# Altium project 28pins_project_V1I1.PrjPcb (part 1 of 3)
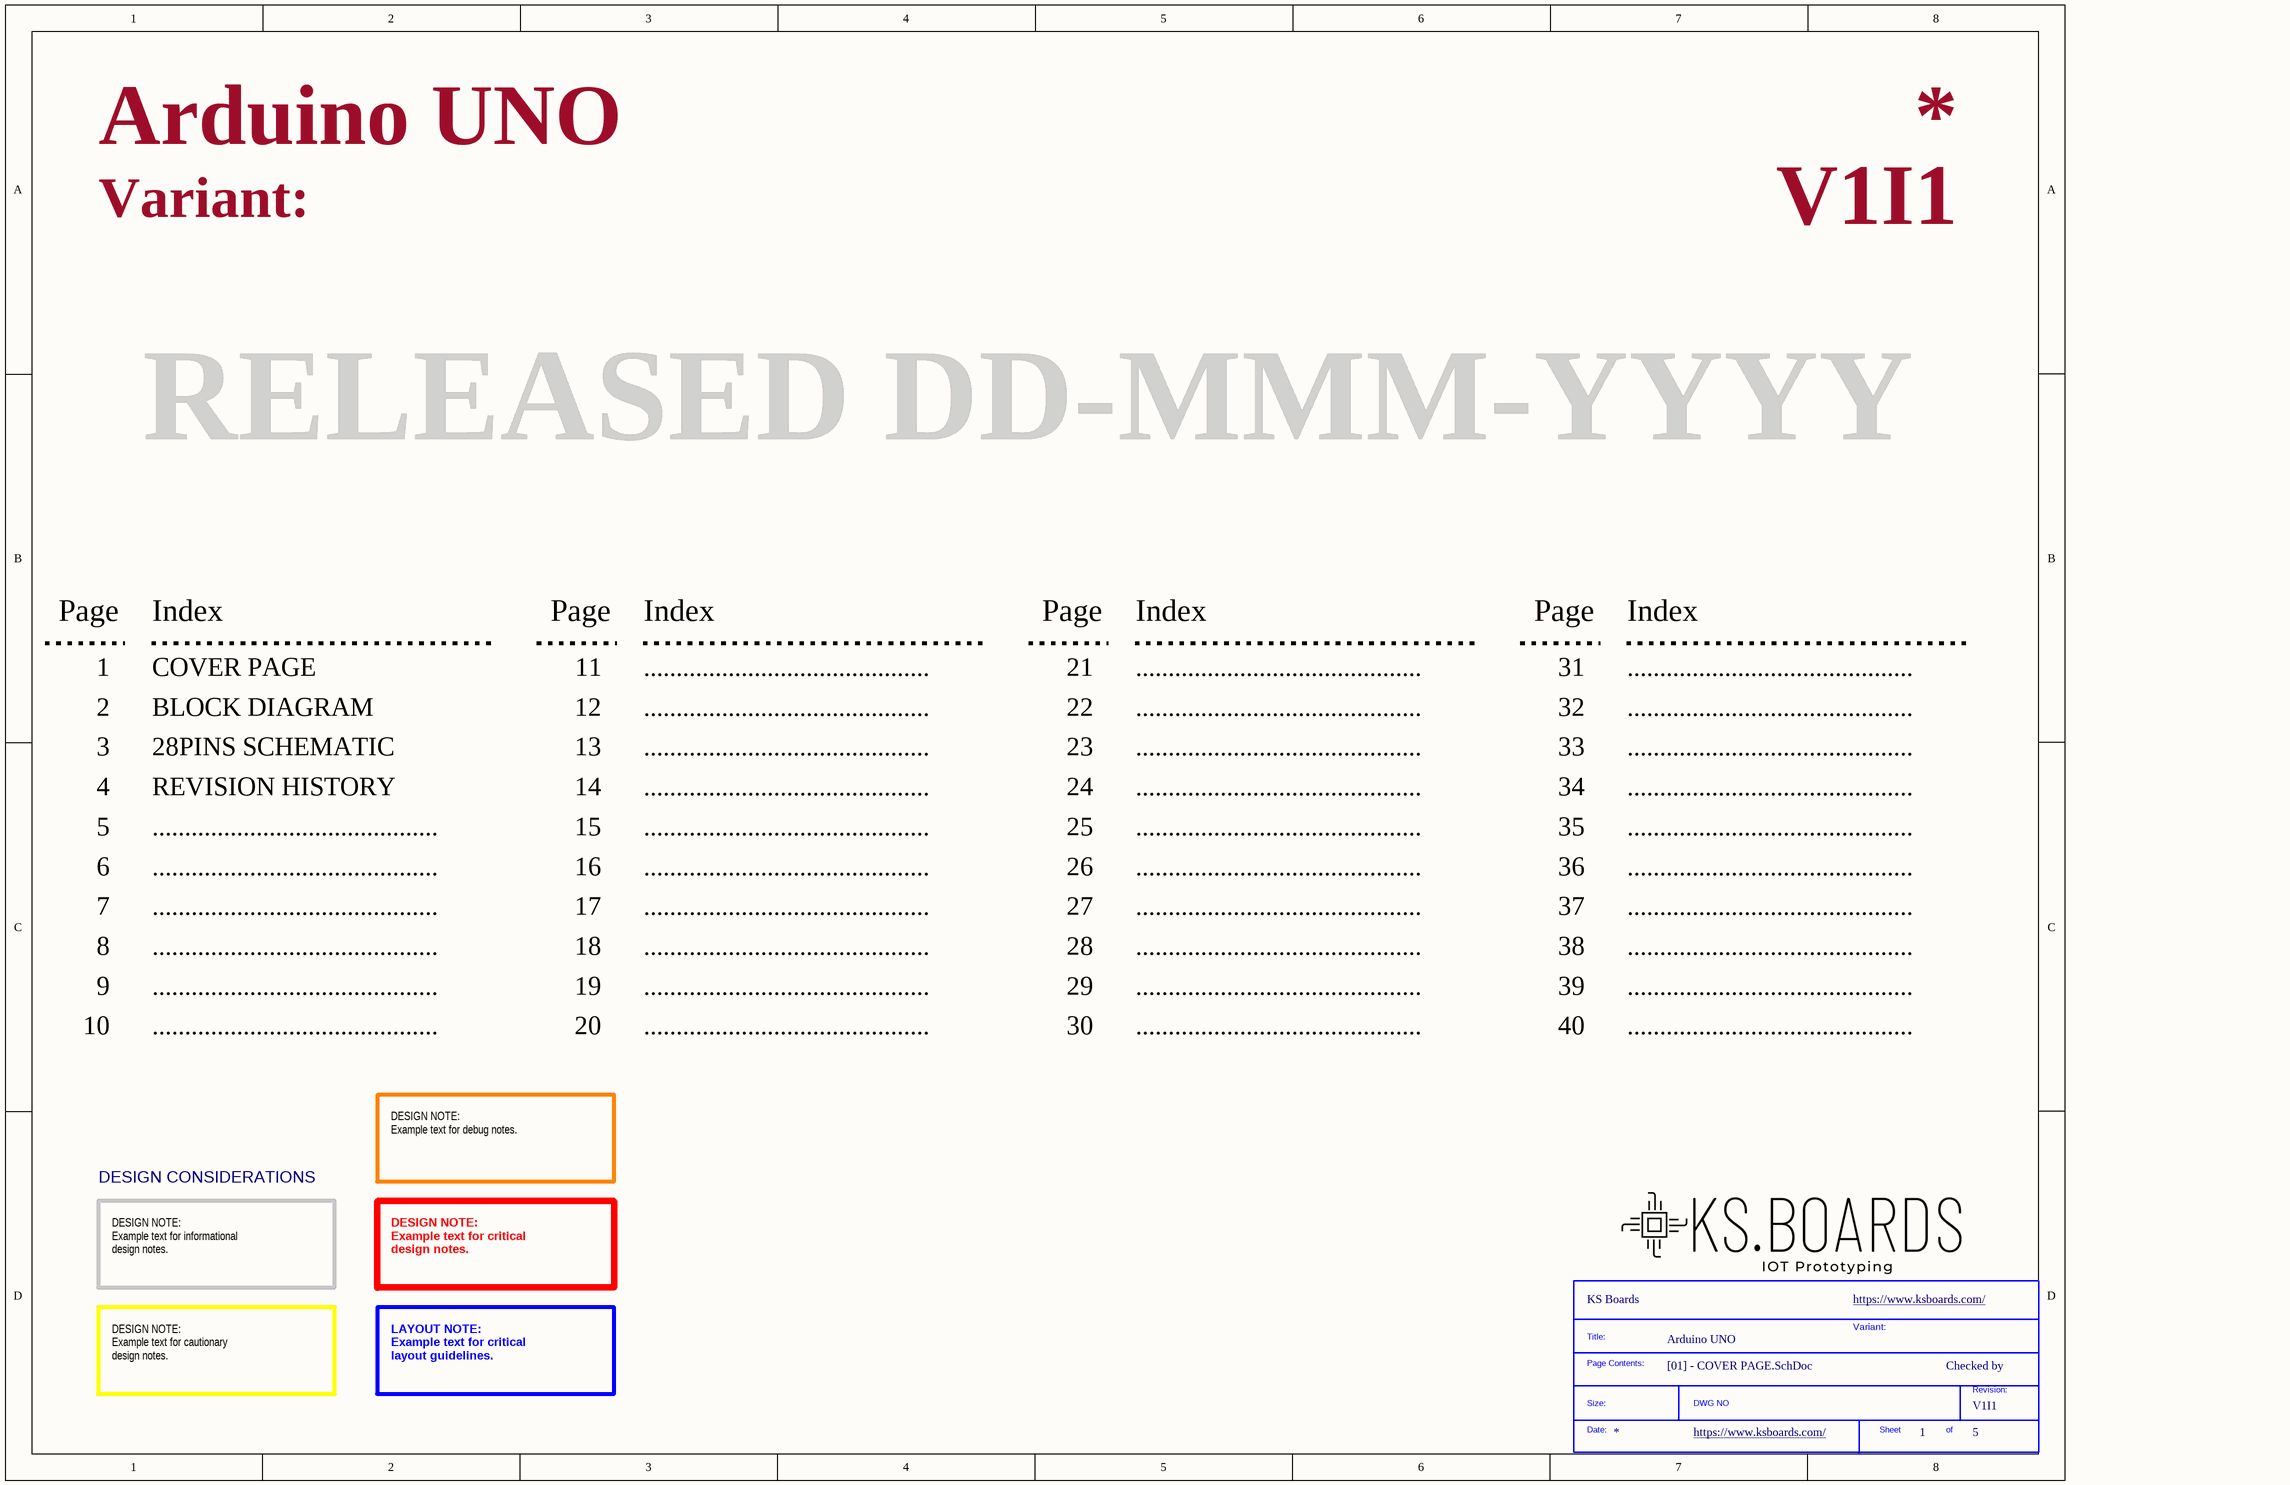
[diagram p0: [01] - COVER PAGE.SchDoc]
Company: KS Boards; Not fitted: NF; Project: Arduino UNO; Title: Arduino Uno; URL: https://www.ksboards.com/; VersionRevision: V1I1
4 sheets, 117 parts. Net scope: global (net labels, ports and power ports of the same name join across sheets).
Board file: 28pins_PCB.PcbDoc
Sheets:
  [01] - COVER PAGE.SchDoc
  [02] - BLOCK DIAGRAM.SchDoc
  [03] - 28PINS SCHEMATIC.SchDoc
  [04] - REVISION HISTORY.SchDoc

## Sheet [01] - COVER PAGE.SchDoc: Arduino Uno
size A3; DocumentNumber: 1; SheetNumber: 1; SheetTotal: 5

### Parts
(Parts that share a designator on the sheet are numbered #1, #2 ... from top to bottom, then left to right.)
*#1  SDTitleBlock  (value not drawn)  (graphical)
LOGO#1  LOGO  (value not drawn)  (graphical)

### Notes on the sheet
- Variant:
- RELEASED DD-MMM-YYYY
- Page
- Index
- 1
- COVER PAGE
- 11
- ............................................
- 21
- 31
- 2
- 3
- BLOCK DIAGRAM
- 28PINS SCHEMATIC
- 12
- 13
- 22
- 23
- 32
- 33
- 4
- 5
- REVISION HISTORY
- 14
- 15
- 24
- 25
- 34
- 35
- 6
- 16
- 26
- 36
- 7
- 8
- 17
- 18
- 27
- 28
- 37
- 38
- 9
- 10
- 19
- 20
- 29
- 30
- 39
- 40
- DESIGN NOTE:
  Example text for debug notes.
- DESIGN CONSIDERATIONS
- DESIGN NOTE:
  Example text for informational
  design notes.
- DESIGN NOTE:
  Example text for critical
  design notes.
- Checked by
- DESIGN NOTE:
  Example text for cautionary
  design notes.
- LAYOUT NOTE:
  Example text for critical
  layout guidelines.
- (in symbol SDTitleBlock) Title:; Page Contents:; Revision:; Size:; DWG NO; Date:; Sheet; of

## Sheet [02] - BLOCK DIAGRAM.SchDoc: Arduino Uno
size A3; DocumentNumber: 2; SheetNumber: 2; SheetTotal: 5; PageSetup: Record=PageOptions|CenterHorizontal=True|CenterVertical=True|PrintScale=0.52|XCorrection=1.00|YCorrection=1.00|PrintKind=1|BorderSize=5000000|LeftOffset=0|BottomOffset=0|Orientation=2|PaperLength=1000|PaperWidth=1000|Scale=100|PaperSource=4|PrintQuality=600|MediaType=1|DitherType=10|PrintScaleMode=1|PaperKind=A4|PaperIndex=9
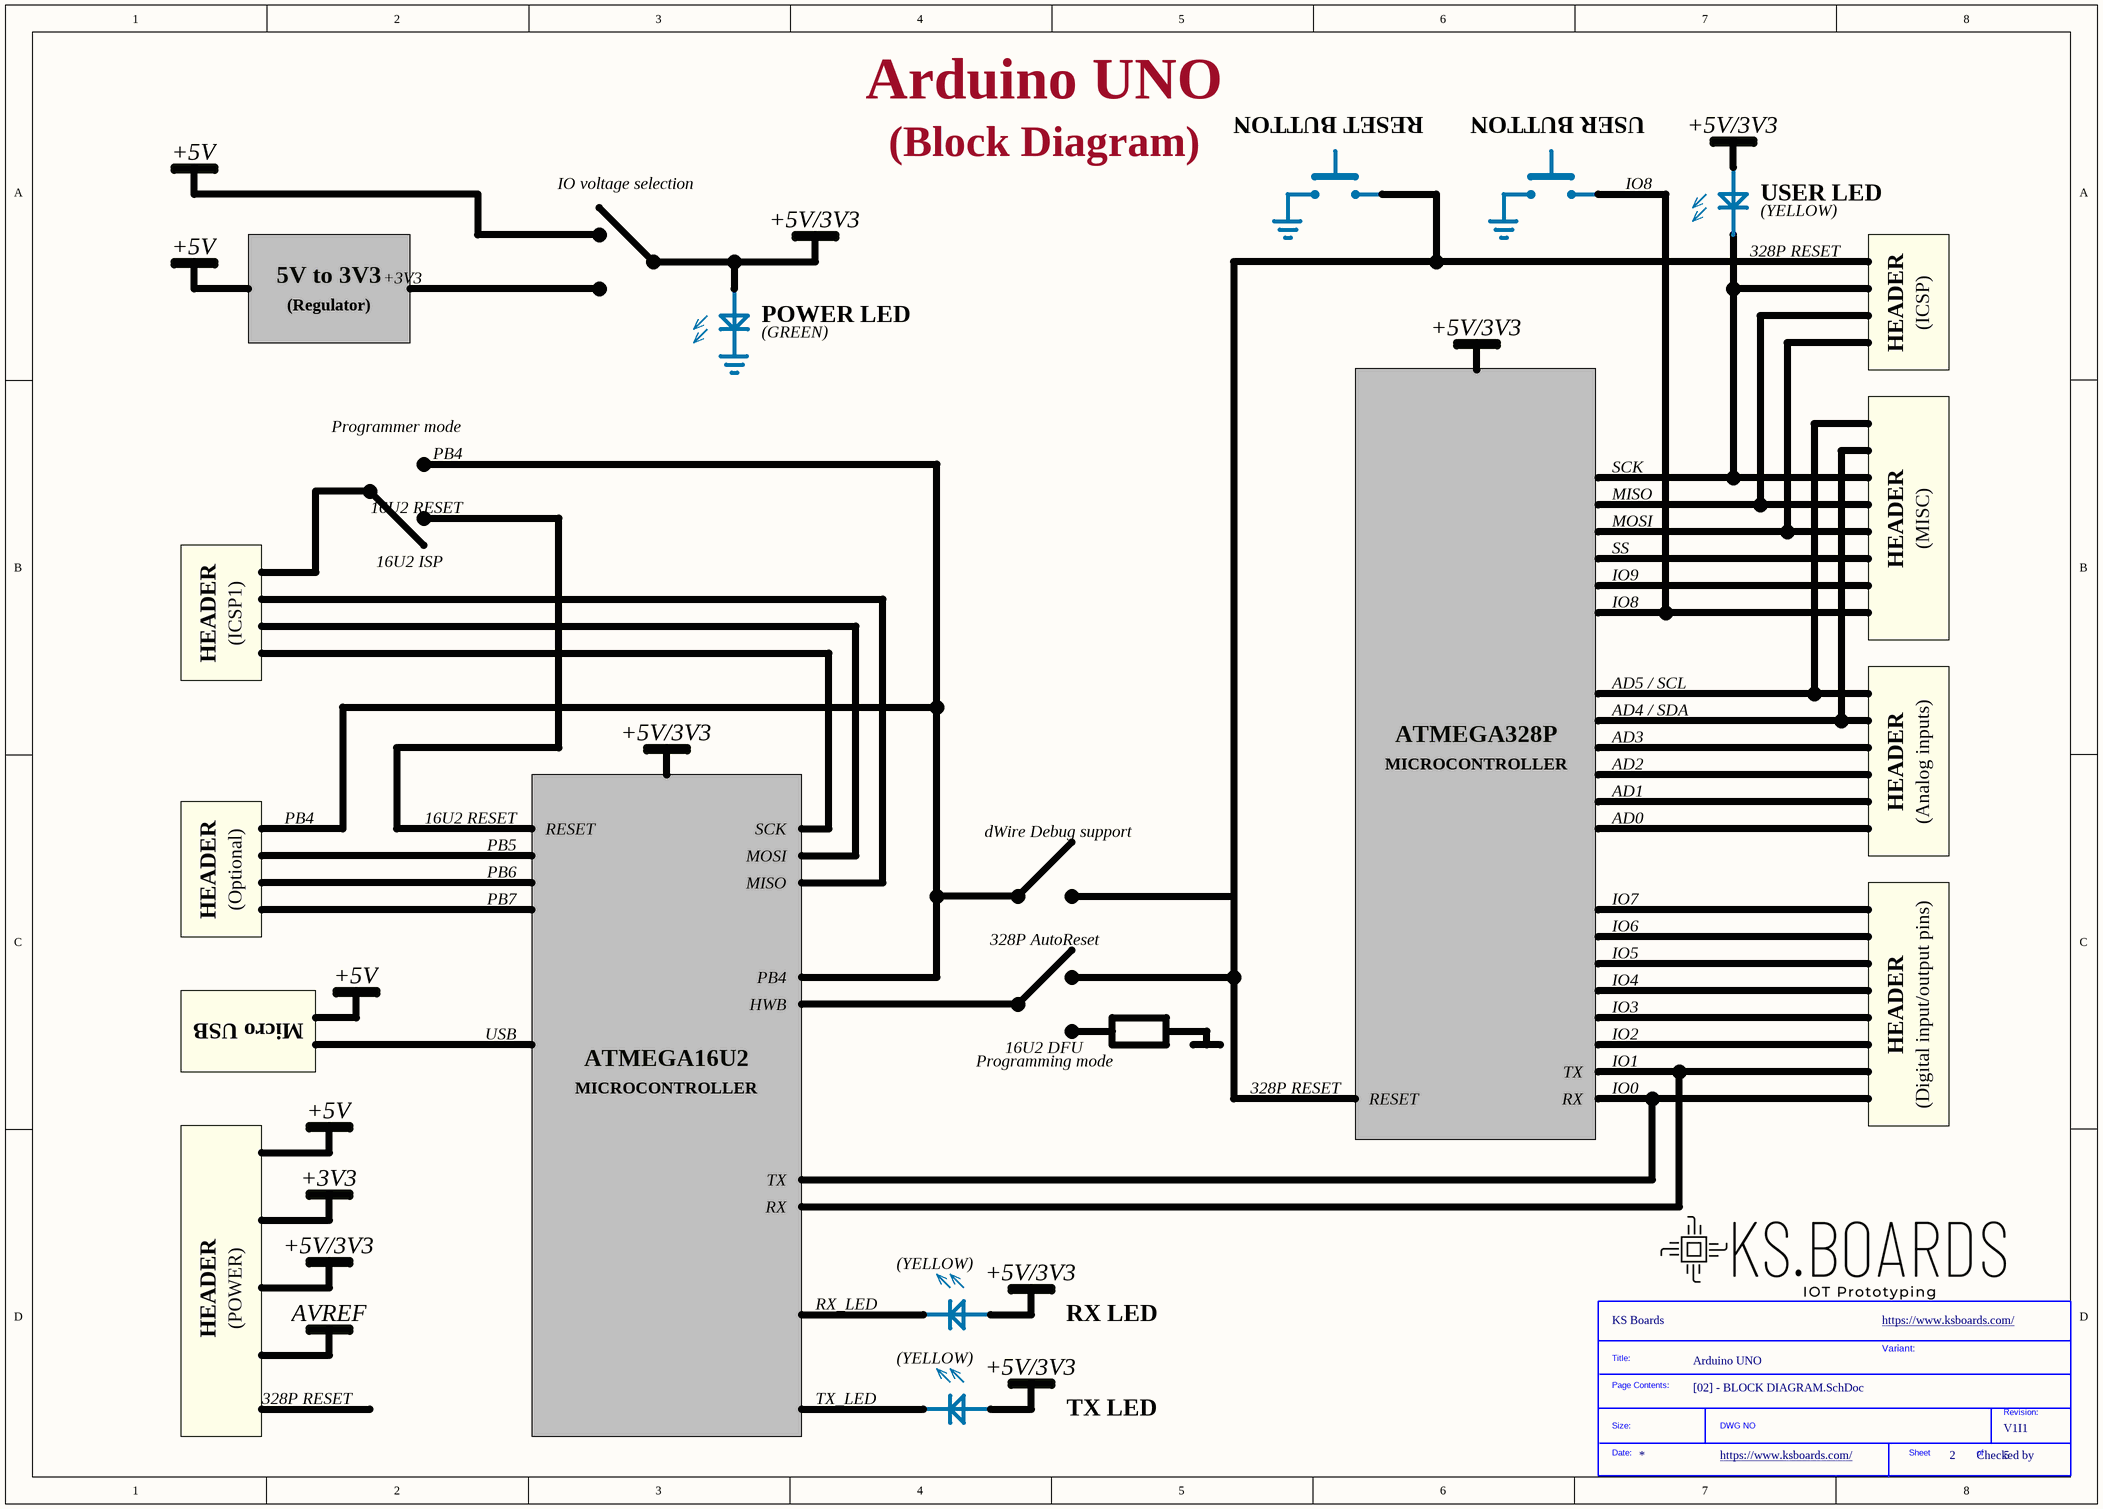
[diagram p1: [02] - BLOCK DIAGRAM.SchDoc]

### Parts
(Parts that share a designator on the sheet are numbered #1, #2 ... from top to bottom, then left to right.)
*#2  SDTitleBlock  (value not drawn)  (graphical)
LOGO#2  LOGO  (value not drawn)  (graphical)

### Notes on the sheet
- +5V
- (Block Diagram)
- RESET BUTTON
- USER BUTTON
- +5V/3V3
- IO voltage selection
- IO8
- USER LED
- (YELLOW)
- 5V to 3V3
- (Regulator)
- +3V3
- 328P RESET
- HEADER
- (ICSP)
- POWER LED
- (GREEN)
- Programmer mode
- PB4
- 16U2 RESET
- MISO
- SCK
- (MISC)
- 16U2 ISP
- SS
- IO9
- MOSI
- (ICSP1)
- AD5 / SCL
- AD4 / SDA
- ATMEGA328P
- MICROCONTROLLER
- AD3
- AD2
- (Analog inputs)
- PB5
- RESET
- dWire Debug support
- AD1
- AD0
- (Optional)
- PB6
- PB7
- IO7
- 328P AutoReset
- IO6
- IO5
- IO4
- Micro USB
- USB
- ATMEGA16U2
- HWB
- 16U2 DFU
- IO3
- IO2
- (Digital input/output pins)
- Programming mode
- RX
- TX
- IO1
- IO0
- (POWER)
- AVREF
- RX_LED
- RX LED
- Variant:
- TX_LED
- TX LED
- Checked by
- (in symbol SDTitleBlock) Title:; Page Contents:; Revision:; Size:; DWG NO; Date:; Sheet; of

## Sheet [03] - 28PINS SCHEMATIC.SchDoc: Arduino Uno
size A2; DocumentNumber: 3; SheetNumber: 3; SheetTotal: 5
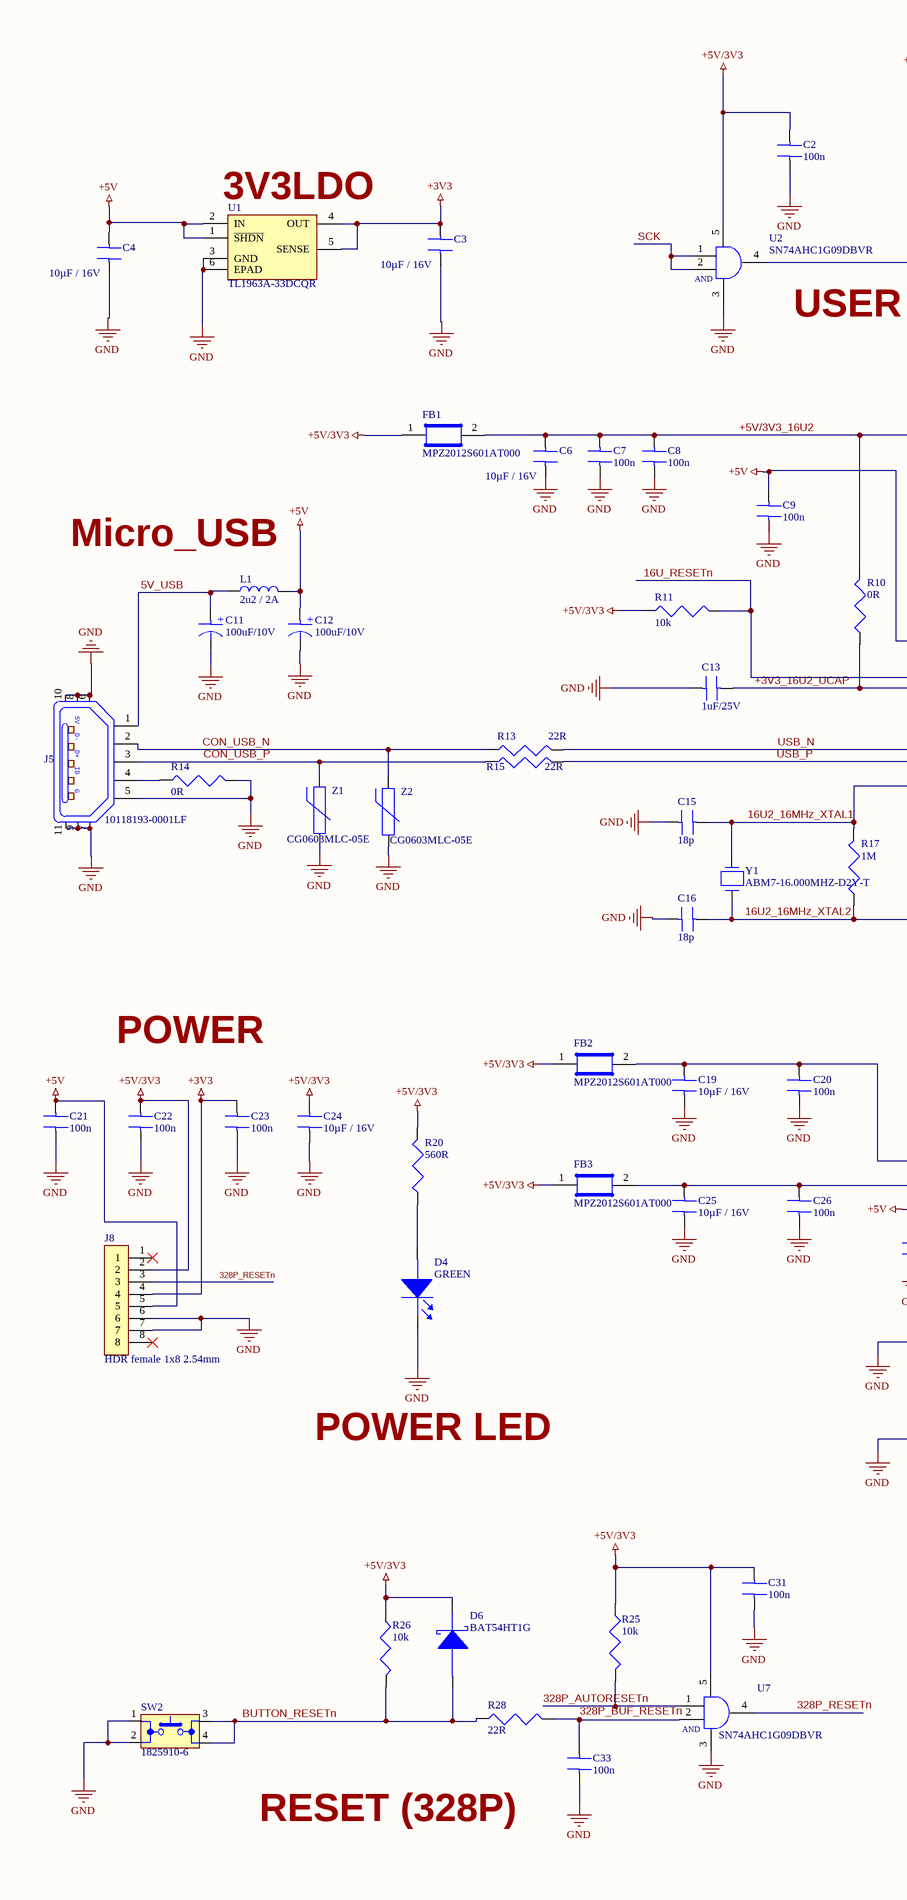
[diagram p2: [03] - 28PINS SCHEMATIC.SchDoc, left]
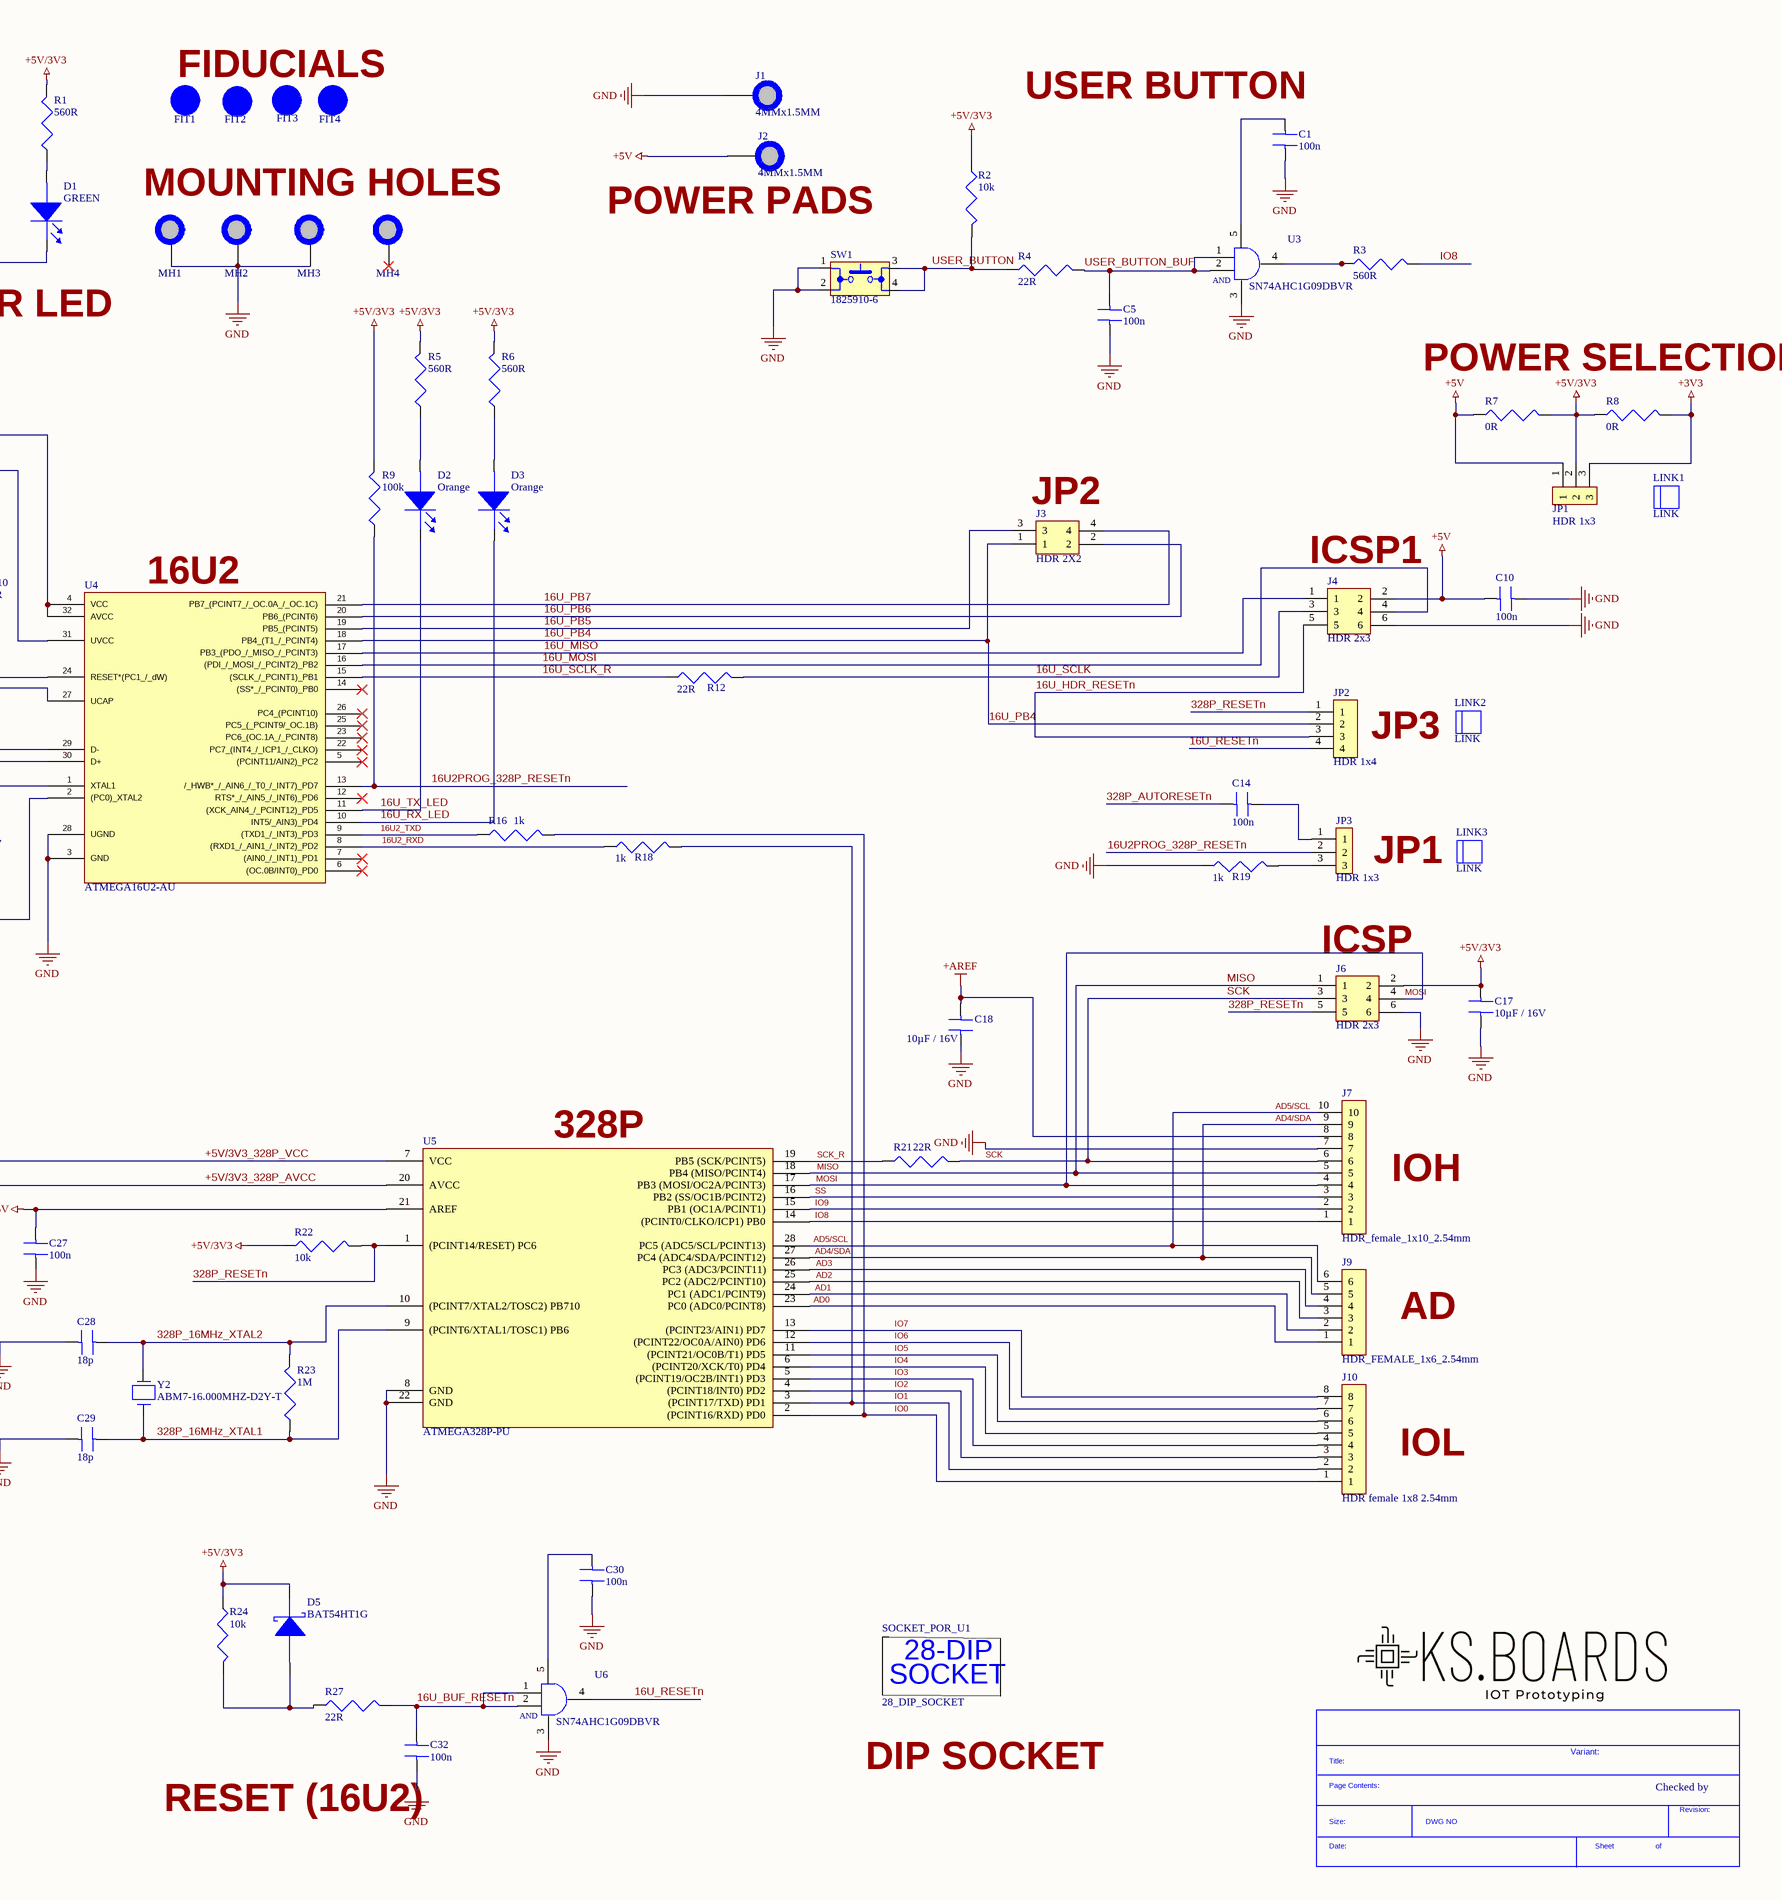
[diagram p3: [03] - 28PINS SCHEMATIC.SchDoc, right]

### Parts
(Parts that share a designator on the sheet are numbered #1, #2 ... from top to bottom, then left to right.)
*?  SDTitleBlock  (value not drawn)  (graphical)
C1  100n  [C0805]
C2  100n  [C0805]
C3  10µF / 16V  [C0805]
C4  10µF / 16V  [C0805]
C5  100n  [C0805]
C6  10µF / 16V  [C0805]
C7  100n  [C0805]
C8  100n  [C0805]
C9  100n  [C0805]
C10  100n  [C0805]
C11  100uF/10V  [C_ALU_C_SIZE]
C12  100uF/10V  [C_ALU_C_SIZE]
C13  1uF/25V  [C0805]
C14  100n  [C0805]
C15  18p  [C0805]
C16  18p  [C0805]
C17  10µF / 16V  [C0805]
C18  10µF / 16V  [C0805]
C19  10µF / 16V  [C0805]
C20  100n  [C0805]
C21  100n  [C0805]
C22  100n  [C0805]
C23  100n  [C0805]
C24  10µF / 16V  [C0805]
C25  10µF / 16V  [C0805]
C26  100n  [C0805]
C27  100n  [C0805]
C28  18p  [C0805]
C29  18p  [C0805]
C30  100n  [C0805]
C31  100n  [C0805]
C32  100n  [C0805]
C33  100n  [C0805]
D1  GREEN  [LED_0603]
D2  Orange  [LED_0603]
D3  Orange  [LED_0603]
D4  GREEN  [LED_0603]
D5  BAT54HT1G  [SOD323]
D6  BAT54HT1G  [SOD323]
FB1  MPZ2012S601AT000  [C0805]
FB2  MPZ2012S601AT000  [C0805]
FB3  MPZ2012S601AT000  [C0805]
FIT1  FIT_1MM  [FIT_40x120]  (value not drawn)  (no BOM)
FIT2  FIT_1MM  [FIT_40x120]  (value not drawn)  (no BOM)
FIT3  FIT_1MM  [FIT_40x120]  (value not drawn)  (no BOM)
FIT4  FIT_1MM  [FIT_40x120]  (value not drawn)  (no BOM)
J1  4MMx1.5MM  [PAD_WITH_HOLE_4MMx1.5MM]  (no BOM)
J2  4MMx1.5MM  [PAD_WITH_HOLE_4MMx1.5MM]  (no BOM)
J3  HDR 2X2  [HDR_2x2_2.54mm]
J4  HDR 2x3  [HDR_2x3_2.54mm]
J5  10118193-0001LF  [10118193]
J6  HDR 2x3  [HDR_2x3_2.54mm]
J7  HDR_female_1x10_2.54mm  [HDR_FEMALE_1x10_2.54mm]
J8  HDR female 1x8 2.54mm  [HDR_FEMALE_1x8_2.54mm]
J9  HDR_FEMALE_1x6_2.54mm  [HDR_FEMALE_1x6_2.54mm]
J10  HDR female 1x8 2.54mm  [HDR_FEMALE_1x8_2.54mm]
JP1  HDR 1x3  [HDR_FEMALE_1x3_2.54mm]
JP2  HDR 1x4  [HDR_FEMALE_1x4_2.54mm]
JP3  HDR 1x3  [HDR_FEMALE_1x3_2.54mm]
L1  2u2 / 2A  [C1210_IND]
LINK1  LINK  (mechanical)
LINK2  LINK  (mechanical)
LINK3  LINK  (mechanical)
LOGO#3  LOGO  (value not drawn)  (graphical)
MH1  MH_7.4MMC_3.4MMD  [MH_7.4MMx3.2MM]  (value not drawn)  (no BOM)
MH2  MH_7.4MMC_3.4MMD  [MH_7.4MMx3.2MM]  (value not drawn)  (no BOM)
MH3  MH_7.4MMC_3.4MMD  [MH_7.4MMx3.2MM]  (value not drawn)  (no BOM)
MH4  MH_7.4MMNC_3.2MMD  [MH_7.4MMC_3.2MMD_NON_COPPER_NPHT]  (value not drawn)  (no BOM)
R1  560R  [R0805]
R2  10k  [R0805]
R3  560R  [R0805]
R4  22R  [R0805]
R5  560R  [R0805]
R6  560R  [R0805]
R7  0R  [R0805]
R8  0R  [R0805]
R9  100k  [R0805]
R10  0R  [R0805]
R11  10k  [R0805]
R12  22R  [R0805]
R13  22R  [R0805]
R14  0R  [R0805]
R15  22R  [R0805]
R16  1k  [R0805]
R17  1M  [R0805]
R18  1k  [R0805]
R19  1k  [R0805]
R20  560R  [R0805]
R21  22R  [R0805]
R22  10k  [R0805]
R23  1M  [R0805]
R24  10k  [R0805]
R25  10k  [R0805]
R26  10k  [R0805]
R27  22R  [R0805]
R28  22R  [R0805]
SOCKET_POR_U1  28_DIP_SOCKET  [28_DIP_7.62MM_SOCKET]
SW1  1825910-6  [1825910-6]
SW2  1825910-6  [1825910-6]
U1  TL1963A-33DCQR  [DCQ-R-PDSO-G6]
U2  SN74AHC1G09DBVR  [DBV_SOT_23]
U3  SN74AHC1G09DBVR  [DBV_SOT_23]
U4  ATMEGA16U2-AU  [TQFP32]
U5  ATMEGA328P-PU  [28_DIP_7.62MM]
U6  SN74AHC1G09DBVR  [DBV_SOT_23]
U7  SN74AHC1G09DBVR  [DBV_SOT_23]
Y1  ABM7-16.000MHZ-D2Y-T  [ABM7_v1_1_BIG]
Y2  ABM7-16.000MHZ-D2Y-T  [ABM7_v1_1_BIG]
Z1  CG0603MLC-05E  [R0603]
Z2  CG0603MLC-05E  [R0603]

### Nets
+3V3: C3.2 C23.2 J8.4 JP1.3 R8.2 U1.4(OUT) U1.5(SENSE)
+5V: C4.2 C9.2 C10.2 C12.1 C21.2 C27.2 J2.1 J4.2 J8.5 JP1.1 L1.2 R7.1 U1.1(~{SHDN}) U1.2(IN) U4.31(UVCC) U5.21(AREF)
+5V/3V3: C2.2 C17.2 C22.2 C24.2 C31.2 D5.1(Cathode) D6.1(Cathode) FB1.1 FB2.1 FB3.1 J6.2 J8.2 JP1.2 R1.2 R2.1 R5.2 R6.2 R7.2 R8.1 R9.2 R11.1 R20.2 R22.1 R24.1 R25.1 R26.1 U2.5 U7.5
+AREF: C18.2 J7.8
GND: C1.1 C2.1 C3.1 C4.1 C5.1 C6.1 C7.1 C8.1 C9.1 C10.1 C11.2 C12.2 C13.1 C15.1 C16.1 C17.1 C18.1 C19.1 C20.1 C21.1 C22.1 C23.1 C24.1 C25.1 C26.1 C27.1 C28.1 C29.1 C30.1 C31.1 C32.1 C33.1 D4.1(Cathode) J1.1 J4.6 J5.5 J5.6 J5.7 J5.8 J5.9 J5.10 J5.11 J6.6 J7.7 J8.6 J8.7 MH1.1 MH2.1 MH3.1 R14.2 R19.1 SW1.1 SW1.2 SW2.1 SW2.2 U1.3(GND) U1.6(EPAD) U2.3 U3.3 U4.3(GND) U4.28(UGND) U5.8(GND) U5.22(GND) U6.3 U7.3 Z1.1 Z2.1
5V_USB: C11.1 J5.1 L1.1
16U2_16MHz_XTAL1: C15.2 R17.2 U4.1(XTAL1) Y1.2
16U2_16MHz_XTAL2: C16.2 R17.1 U4.2((PC0)_XTAL2) Y1.1
16U2_RXD: R18.1 U4.8((RXD1_/_AIN1_/_INT2)_PD2)
16U2_TXD: R16.1 U4.9((TXD1_/_INT3)_PD3)
16U2PROG_328P_RESETn: JP3.2 R9.1 U4.13(/_HWB*_/_AIN6_/_T0_/_INT7)_PD7)
16U_BUF_RESETn: C32.2 R27.2 U6.1 U6.2
16U_HDR_RESETn: J4.5 JP2.3
16U_MISO: J4.1 U4.17(PB3_(PDO_/_MISO_/_PCINT3))
16U_MOSI: J4.4 U4.16((PDI_/_MOSI_/_PCINT2)_PB2)
16U_PB4: J3.1 JP2.2 U4.18(PB4_(T1_/_PCINT4))
16U_PB5: J3.3 U4.19(PB5_(PCINT5))
16U_PB6: J3.2 U4.20(PB6_(PCINT6))
16U_PB7: J3.4 U4.21(PB7_(PCINT7_/_OC.0A_/_OC.1C))
16U_RESETn: JP2.4 R11.2 U4.24(RESET*(PC1_/_dW)) U6.4
16U_RX_LED: D3.1(Cathode) U4.10(INT5/_AIN3)_PD4)
16U_SCLK: J4.3 R12.2
16U_SCLK_R: R12.1 U4.15((SCLK_/_PCINT1)_PB1)
16U_TX_LED: D2.1(Cathode) U4.11((XCK_AIN4_/_PCINT12)_PD5)
328P_16MHz_XTAL1: C29.2 R23.1 U5.9((PCINT6/XTAL1/TOSC1)_PB6) Y2.1
328P_16MHz_XTAL2: C28.2 R23.2 U5.10((PCINT7/XTAL2/TOSC2)_PB710) Y2.2
328P_AUTORESETn: C14.2 R25.2 U7.1
328P_BUF_RESETn: C33.2 R28.2 U7.2
328P_RESETn: J6.5 J8.3 JP2.1 R22.2 U5.1((PCINT14/RESET)_PC6) U7.4
+3V3_16U2_UCAP: C13.2 R10.1 U4.27(UCAP)
+5V/3V3_16U2: C6.2 C7.2 C8.2 FB1.2 R10.2 U4.4(VCC) U4.32(AVCC)
+5V/3V3_328P_AVCC: C25.2 C26.2 FB3.2 U5.20(AVCC)
+5V/3V3_328P_VCC: C19.2 C20.2 FB2.2 U5.7(VCC)
AD0: J9.1 U5.23(PC0_(ADC0/PCINT8))
AD1: J9.2 U5.24(PC1_(ADC1/PCINT9))
AD2: J9.3 U5.25(PC2_(ADC2/PCINT10))
AD3: J9.4 U5.26(PC3_(ADC3/PCINT11))
AD4/SDA: J7.9 J9.5 U5.27(PC4_(ADC4/SDA/PCINT12))
AD5/SCL: J7.10 J9.6 U5.28(PC5_(ADC5/SCL/PCINT13))
BUTTON_RESETn: D6.2(Anode) R26.2 R28.1 SW2.3 SW2.4
CON_USB_N: J5.2 R13.1 Z2.2
CON_USB_P: J5.3 R15.1 Z1.2
IO0: J10.1 R16.2 U5.2((PCINT16/RXD)_PD0)
IO1: J10.2 R18.2 U5.3((PCINT17/TXD)_PD1)
IO2: J10.3 U5.4((PCINT18/INT0)_PD2)
IO3: J10.4 U5.5((PCINT19/OC2B/INT1)_PD3)
IO4: J10.5 U5.6((PCINT20/XCK/T0)_PD4)
IO5: J10.6 U5.11((PCINT21/OC0B/T1)_PD5)
IO6: J10.7 U5.12((PCINT22/OC0A/AIN0)_PD6)
IO7: J10.8 U5.13((PCINT23/AIN1)_PD7)
IO8: J7.1 R3.2 U5.14((PCINT0/CLKO/ICP1)_PB0)
IO9: J7.2 U5.15(PB1_(OC1A/PCINT1))
MISO: J6.1 J7.5 U5.18(PB4_(MISO/PCINT4))
MOSI: J6.4 J7.4 U5.17(PB3_(MOSI/OC2A/PCINT3))
SCK: J6.3 J7.6 R21.2 U2.1 U2.2
SCK_R: R21.1 U5.19(PB5_(SCK/PCINT5))
SS: J7.3 U5.16(PB2_(SS/OC1B/PCINT2))
USB_N: R13.2 U4.29(D-)
USB_P: R15.2 U4.30(D+)
USER_BUTTON: R2.2 R4.1 SW1.3 SW1.4
USER_BUTTON_BUF: C5.2 R4.2 U3.1 U3.2
NetC1_2: C1.2 U3.5
NetC14_1: C14.1 JP3.1
NetC30_2: C30.2 U6.5
NetD1_1: D1.1(Cathode) U2.4
NetD1_2: D1.2(Anode) R1.1
NetD2_2: D2.2(Anode) R5.1
NetD3_2: D3.2(Anode) R6.1
NetD4_2: D4.2(Anode) R20.1
NetD5_2: D5.2(Anode) R24.2 R27.1
NetJ5_4: J5.4 R14.1
NetJP3_3: JP3.3 R19.2
NetR3_1: R3.1 U3.4

Not connected (* = marked no-connect by the designer): J8 1* 8*; MH4 1*; U4 5((PCINT11/AIN2)_PC2)* 6((OC.0B/INT0)_PD0)* 7((AIN0_/_INT1)_PD1)* 12(RTS*_/_AIN5_/_INT6)_PD6)* 14((SS*_/_PCINT0)_PB0)* 22(PC7_(INT4_/_ICP1_/_CLKO))* 23(PC6_(OC.1A_/_PCINT8))* 25(PC5_(_PCINT9/_OC.1B))* 26(PC4_(PCINT10))*

### Notes on the sheet
- FIDUCIALS
- USER BUTTON
- (near U1) 3V3LDO
- MOUNTING HOLES
- (near J2) POWER PADS
- USER LED
- POWER SELECTION
- (near J3) JP2
- (near L1) Micro_USB
- (near U4) 16U2
- (near J4) ICSP1
- JP3
- JP1
- (near J6) ICSP
- POWER
- (near U5) 328P
- IOH
- AD
- POWER LED
- IOL
- DIP SOCKET
- Variant:
- Checked by
- RESET (328P)
- (near C32) RESET (16U2)
- Title
- Size:
- Date:
- File:
- A2
- Number:
- Time:
- Revision:
- Sheet
- of
- (in symbol 4828-3004-CP) 28-DIP; SOCKET
- (in symbol 10118193-0001LF) 5V; D-; D+; ID; G
- (in symbol EEE-1AA101WR) +
- (in symbol SDTitleBlock) Title:; Page Contents:; Revision:; Size:; DWG NO; Date:; Sheet; of
- (in symbol SN74AHC1G09DBVR) AND